# EAGLE board PCB-E21-CMB6_v11-16 (EAGLE 7.7.0), part 1 of 2
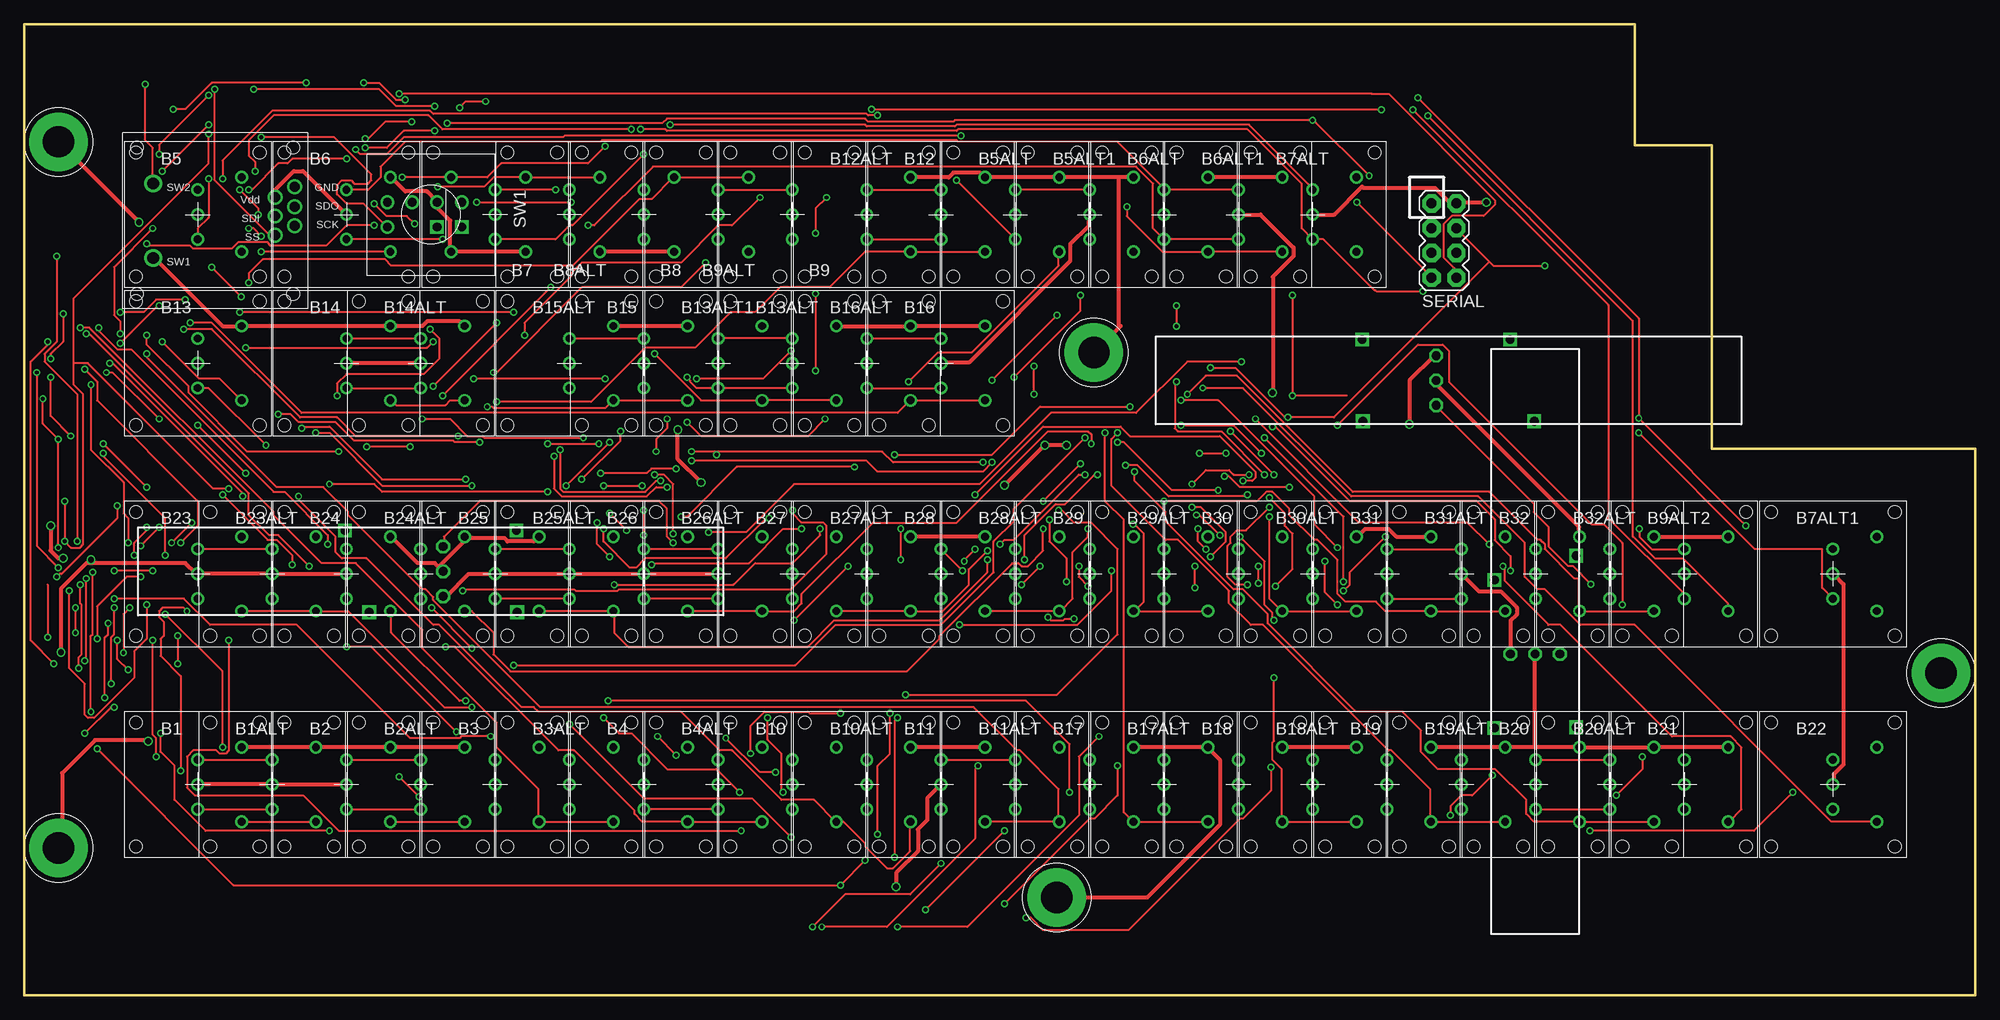
[diagram p6: board, top side]
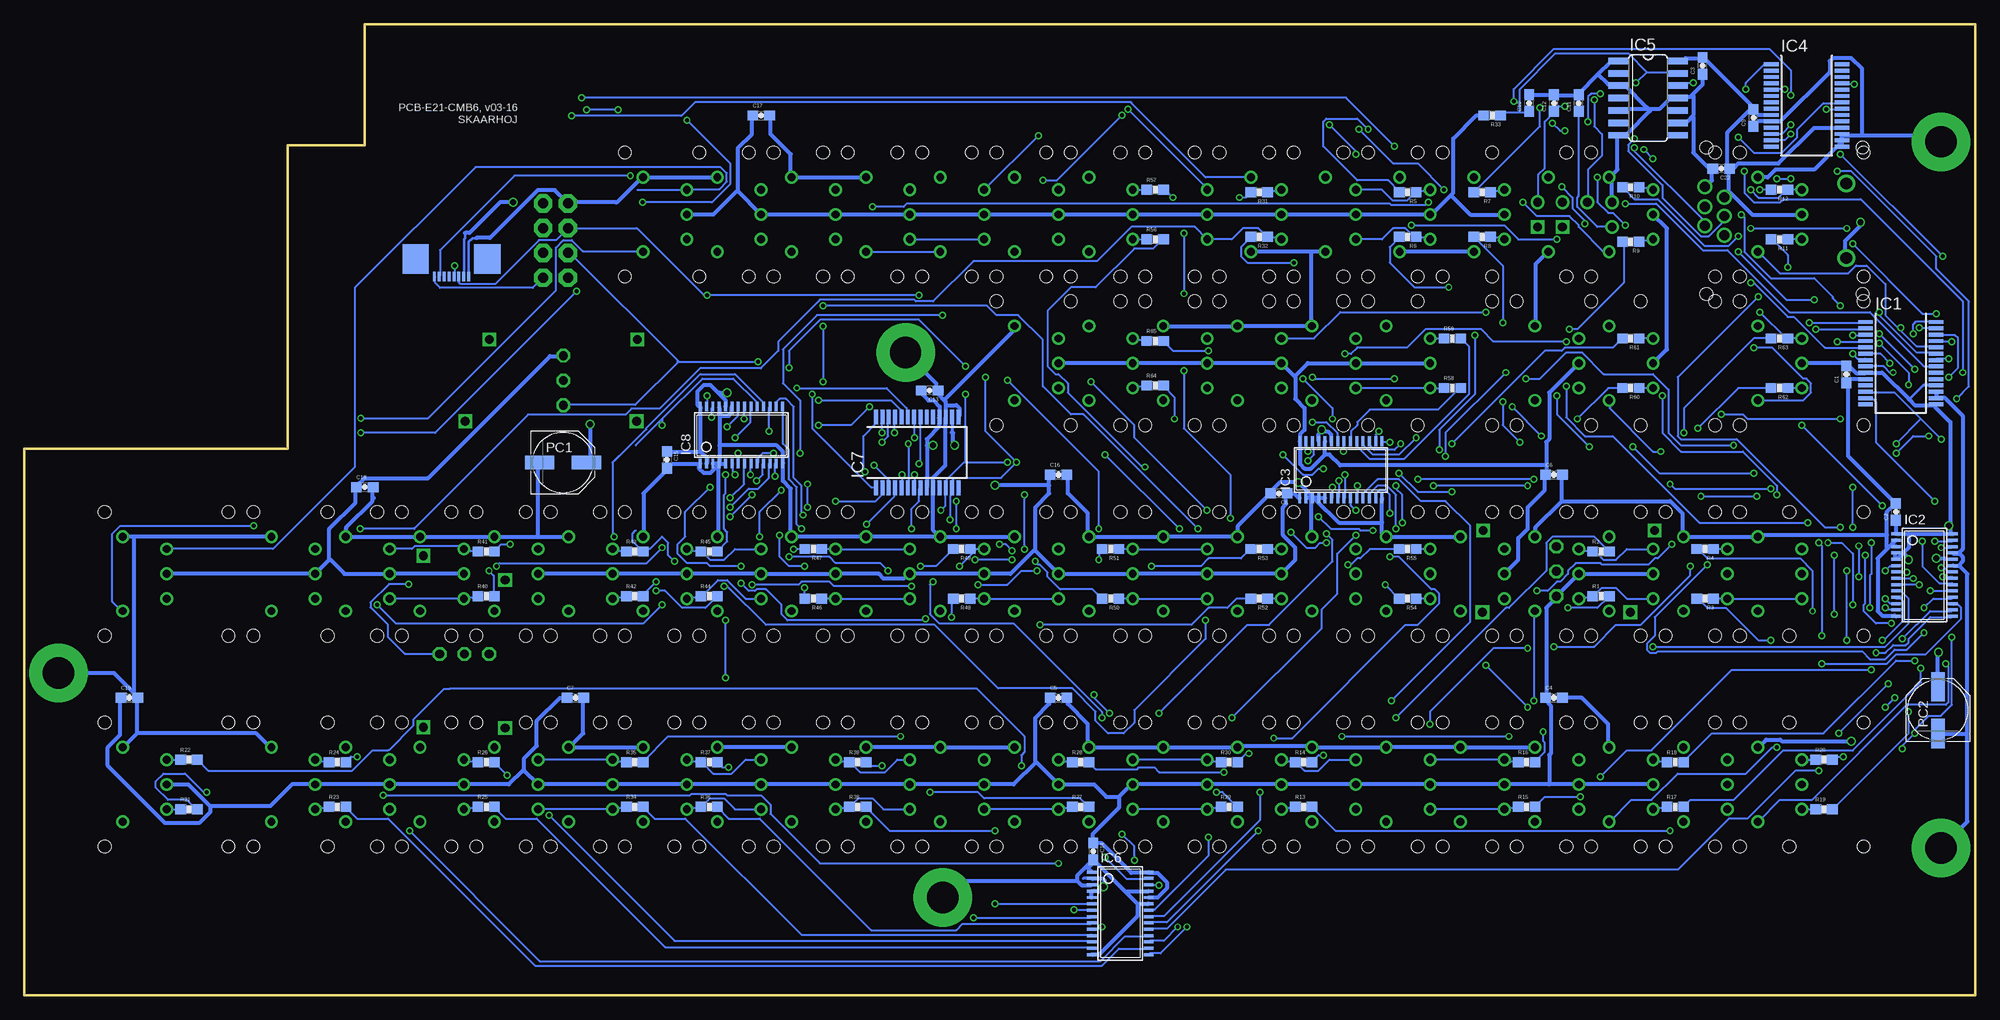
[diagram p7: board, bottom side, seen from below]

Size 200 x 99.5 mm. Coordinates in mm from the lower left corner, seen from the top.
Outline: 0,99.5 0,0 200,0 200,56 173.03,56 173.03,87.12 165.1,87.12 165.1,99.5 0,99.5
Copper layers (1*16): Top 0.035mm / dielectric 1.5mm / Bottom 0.035mm
Design rules "Fusion_eagle_rule_v1.1": minimum track width 6mil, minimum drill 12mil, track to track 6mil, track to pad 6mil, pad to pad 6mil, via to via 6mil, smd to smd 0mil, copper to edge 10mil, drill to drill 10mil, minimum pad ring 10mil, minimum via ring 6mil, stop-mask expansion 2mil, vias tented up to drill 100mil, thermal gap 10mil
Net classes: 0 default: width 0.203 mm, drill 0.406 mm, clearance 0.152 mm; 1 Power: width 0.406 mm, drill 0.61 mm, clearance 0.203 mm
tRestrict: area 0,0 to 223,6.5; area 0,94 to 223,100
bRestrict: area 0,97.5 to 223,100; area 0,0 to 223,2.5

## Footprints (pad centres in the part's own frame; a part is rotated, then mirrored left to right if it is on the bottom)
LP11 = drill 0.8: COM 0,0; P$2 0,2.54; P$3 0,-2.54; P$4 4.5,3.81; P$5 4.5,-3.81 | hole 1.3: -6.35,6.35; 6.35,6.35; 6.35,-6.35; -6.35,-6.35
0603-CAP = smd 1.1 x 1: 1 -0.85,0; 2 0.85,0
SSOP28 = smd 0.4 x 1.5: 1 -4.225,-3.625; 2 -3.575,-3.625; 3 -2.925,-3.625; 4 -2.275,-3.625; 5 -1.625,-3.625; 6 -0.975,-3.625; 7 -0.325,-3.625; 8 0.325,-3.625; 9 0.975,-3.625; 10 1.625,-3.625; 11 2.275,-3.625; 12 2.925,-3.625; 13 3.575,-3.625; 14 4.225,-3.625; 15 4.225,3.625; 16 3.575,3.625; 17 2.925,3.625; 18 2.275,3.625; 19 1.625,3.625; 20 0.975,3.625; 21 0.325,3.625; 22 -0.325,3.625; 23 -0.975,3.625; 24 -1.625,3.625; 25 -2.275,3.625; 26 -2.925,3.625; 27 -3.575,3.625; 28 -4.225,3.625
TSSOP28 = smd 0.305 x 0.991: 1 -4.225,-2.918; 2 -3.575,-2.918; 3 -2.925,-2.918; 4 -2.275,-2.918; 5 -1.625,-2.918; 6 -0.975,-2.918; 7 -0.325,-2.918; 8 0.325,-2.918; 9 0.975,-2.918; 10 1.625,-2.918; 11 2.275,-2.918; 12 2.925,-2.918; 13 3.575,-2.918; 14 4.225,-2.918; 15 4.225,2.918; 16 3.575,2.918; 17 2.925,2.918; 18 2.275,2.918; 19 1.625,2.918; 20 0.975,2.918; 21 0.325,2.918; 22 -0.325,2.918; 23 -0.975,2.918; 24 -1.625,2.918; 25 -2.275,2.918; 26 -2.925,2.918; 27 -3.575,2.918; 28 -4.225,2.918
SO14 = smd 0.66 x 2.032: 1 -3.81,-3.073; 2 -2.54,-3.073; 3 -1.27,-3.073; 4 0,-3.073; 5 1.27,-3.073; 6 2.54,-3.073; 7 3.81,-3.073; 8 3.81,3.073; 9 2.54,3.073; 10 1.27,3.073; 11 0,3.073; 12 -1.27,3.073; 13 -2.54,3.073; 14 -3.81,3.073
PANASONIC_D = smd 3 x 1.4: + 2.4,0; - -2.4,0
SLIDER45-CAR1 = drill 0.9 octagon: 1 -1.27,2.54; 2A -1.27,-2.54; 3 -1.27,0 | drill 0.9 square: P$1 -8.852,4.191; P$2 6.312,4.191; P$3 8.788,-4.191; P$4 -8.788,-4.191
0603-RES = smd 1.1 x 1: 1 -0.85,0; 2 0.85,0
2X4 = drill 1.016 pad 1.88 octagon: 1 -3.81,-1.27; 2 -3.81,1.27; 3 -1.27,-1.27; 4 -1.27,1.27; 5 1.27,-1.27; 6 1.27,1.27; 7 3.81,-1.27; 8 3.81,1.27
SMART_SWITCH = drill 1.2: 1 6.35,3.81; 2 6.35,-3.81 | drill 1: 3 -8.153,-3.48; 4 -6.147,-2.413; 5 -8.153,-1.422; 6 -6.147,-0.483; 7 -8.153,0.508; 8 -6.147,1.499 | hole 1.3: -8.001,7.506; 8.001,7.506; 8.001,-7.506; -8.001,-7.506
ALPS_EC12E_SW-CAR1 = drill 0.9: A 1.27,-4.445; B -1.27,-1.905; C -1.27,-4.445; D -1.27,0.635; E -1.27,3.175 | drill 0.9 square: GND1 1.27,3.175; GND2 1.27,0.635
3.2MMPAD6MM = drill 3.2 pad 6: P$1 0,0
ZIP-8-0.5 = smd 2.7 x 3: GND$1 3.68,-1.8; GND$9 -3.68,-1.8 | smd 0.3 x 0.96: P$1 -1.75,0; P$2 -1.25,0; P$3 -0.75,0; P$4 -0.25,0; P$5 0.25,0; P$6 0.75,0; P$7 1.25,0; P$8 1.75,0

## Placement (x,y rotation side)
B1  LP11-B"  [LP11]  17.78,21.59 0 top
B1ALT  LP11-B"  [LP11]  25.4,21.59 0 top
B2  LP11-B"  [LP11]  33.02,21.59 0 top
B2ALT  LP11-B"  [LP11]  40.64,21.59 0 top
B3  LP11-B"  [LP11]  48.26,21.59 0 top
B3ALT  LP11-B"  [LP11]  55.88,21.59 0 top
B4  LP11-B"  [LP11]  63.5,21.59 0 top
B4ALT  LP11-B"  [LP11]  71.12,21.59 0 top
B5  LP11-B"  [LP11]  17.78,80.01 0 top
B5ALT  LP11-B"  [LP11]  101.6,80.01 0 top
B5ALT1  LP11-B"  [LP11]  109.22,80.01 0 top
B6  LP11-B"  [LP11]  33.02,80.01 0 top
B6ALT  LP11-B"  [LP11]  116.84,80.01 0 top
B6ALT1  LP11-B"  [LP11]  124.46,80.01 0 top
B7  LP11-B"  [LP11]  48.26,80.01 180 top
B7ALT  LP11-B"  [LP11]  132.08,80.01 0 top
B7ALT1  LP11-B"  [LP11]  185.42,43.18 0 top
B8  LP11-B"  [LP11]  63.5,80.01 180 top
B8ALT  LP11-B"  [LP11]  55.88,80.01 180 top
B9  LP11-B"  [LP11]  78.74,80.01 180 top
B9ALT  LP11-B"  [LP11]  71.12,80.01 180 top
B9ALT2  LP11-B"  [LP11]  170.18,43.18 0 top
B10  LP11-B"  [LP11]  78.74,21.59 0 top
B10ALT  LP11-B"  [LP11]  86.36,21.59 0 top
B11  LP11-B"  [LP11]  93.98,21.59 0 top
B11ALT  LP11-B"  [LP11]  101.6,21.59 0 top
B12  LP11-B"  [LP11]  93.98,80.01 0 top
B12ALT  LP11-B"  [LP11]  86.36,80.01 0 top
B13  LP11-B"  [LP11]  17.78,64.77 0 top
B13ALT  LP11-B"  [LP11]  78.74,64.77 0 top
B13ALT1  LP11-B"  [LP11]  71.12,64.77 0 top
B14  LP11-B"  [LP11]  33.02,64.77 0 top
B14ALT  LP11-B"  [LP11]  40.64,64.77 0 top
B15  LP11-B"  [LP11]  63.5,64.77 0 top
B15ALT  LP11-B"  [LP11]  55.88,64.77 0 top
B16  LP11-B"  [LP11]  93.98,64.77 0 top
B16ALT  LP11-B"  [LP11]  86.36,64.77 0 top
B17  LP11-B"  [LP11]  109.22,21.59 0 top
B17ALT  LP11-B"  [LP11]  116.84,21.59 0 top
B18  LP11-B"  [LP11]  124.46,21.59 0 top
B18ALT  LP11-B"  [LP11]  132.08,21.59 0 top
B19  LP11-B"  [LP11]  139.7,21.59 0 top
B19ALT  LP11-B"  [LP11]  147.32,21.59 0 top
B20  LP11-B"  [LP11]  154.94,21.59 0 top
B20ALT  LP11-B"  [LP11]  162.56,21.59 0 top
B21  LP11-B"  [LP11]  170.18,21.59 0 top
B22  LP11-B"  [LP11]  185.42,21.59 0 top
B23  LP11-B"  [LP11]  17.78,43.18 0 top
B23ALT  LP11-B"  [LP11]  25.4,43.18 0 top
B24  LP11-B"  [LP11]  33.02,43.18 0 top
B24ALT  LP11-B"  [LP11]  40.64,43.18 0 top
B25  LP11-B"  [LP11]  48.26,43.18 0 top
B25ALT  LP11-B"  [LP11]  55.88,43.18 0 top
B26  LP11-B"  [LP11]  63.5,43.18 0 top
B26ALT  LP11-B"  [LP11]  71.12,43.18 0 top
B27  LP11-B"  [LP11]  78.74,43.18 0 top
B27ALT  LP11-B"  [LP11]  86.36,43.18 0 top
B28  LP11-B"  [LP11]  93.98,43.18 0 top
B28ALT  LP11-B"  [LP11]  101.6,43.18 0 top
B29  LP11-B"  [LP11]  109.22,43.18 0 top
B29ALT  LP11-B"  [LP11]  116.84,43.18 0 top
B30  LP11-B"  [LP11]  124.46,43.18 0 top
B30ALT  LP11-B"  [LP11]  132.08,43.18 0 top
B31  LP11-B"  [LP11]  139.7,43.18 0 top
B31ALT  LP11-B"  [LP11]  147.32,43.18 0 top
B32  LP11-B"  [LP11]  154.94,43.18 0 top
B32ALT  LP11-B"  [LP11]  162.56,43.18 0 top
C1  100nF  [0603-CAP]  13.21,63.63 90 bottom
C2  100nF  [0603-CAP]  8.13,49.53 90 bottom
C3  100nF  [0603-CAP]  27.94,95.25 90 bottom
C4  100nF  [0603-CAP]  43.18,30.48 0 bottom
C5  100nF  [0603-CAP]  93.98,30.48 0 bottom
C6  100nF  [0603-CAP]  43.18,53.34 0 bottom
C7  100nF  [0603-CAP]  143.51,30.48 0 bottom
C8  100nF  [0603-CAP]  71.37,51.44 180 bottom
C9  100nF  [0603-CAP]  22.73,89.92 90 bottom
C10  10nF  [0603-CAP]  45.72,91.44 90 bottom
C11  10nF  [0603-CAP]  40.64,91.44 90 bottom
C12  10nF  [0603-CAP]  43.18,91.44 90 bottom
C13  100nF  [0603-CAP]  107.19,61.98 180 bottom
C14  100nF  [0603-CAP]  90.42,14.73 270 bottom
C15  100nF  [0603-CAP]  134.11,54.86 270 bottom
C16  100nF  [0603-CAP]  93.98,53.34 0 bottom
C17  100nF  [0603-CAP]  124.46,90.17 0 bottom
C18  100nF  [0603-CAP]  165.1,52.07 0 bottom
C19  100nF  [0603-CAP]  189.23,30.48 0 bottom
C22  100nF  [0603-CAP]  26.04,84.71 180 bottom
IC1  MCP23017SS  [SSOP28]  7.62,64.77 270 bottom
IC2  PCA9685  [TSSOP28]  5.21,43.05 270 bottom
IC3  PCA9685  [TSSOP28]  65.02,53.85 0 bottom
IC4  MCP23017SS  [SSOP28]  17.27,91.19 270 bottom
IC5  74HCT14D  [SO14]  33.53,91.95 270 bottom
IC6  PCA9685  [TSSOP28]  87.63,8.38 270 bottom
IC7  MCP23017SS  [SSOP28]  108.46,55.63 0 bottom
IC8  PCA9685  [TSSOP28]  126.49,57.4 0 bottom
PC1  47u  [PANASONIC_D]  144.78,54.61 0 bottom
PC2  47u  [PANASONIC_D]  3.81,29.21 90 bottom
POT1  SLIDERC45  [SLIDER45-CAR1]  41.66,43.43 180 top
POT1ALT  SLIDERC45  [SLIDER45-CAR1]  146.01,63.01 0 top
POT2  SLIDERC45  [SLIDER45-CAR1]  154.89,36.24 90 top
R1  270  [0603-RES]  38.35,40.89 0 bottom
R2  270  [0603-RES]  38.35,45.47 0 bottom
R3  270  [0603-RES]  27.69,40.64 180 bottom
R4  270  [0603-RES]  27.69,45.72 180 bottom
R5  270  [0603-RES]  58.17,82.3 180 bottom
R6  270  [0603-RES]  58.17,77.72 180 bottom
R7  270  [0603-RES]  50.55,82.3 180 bottom
R8  270  [0603-RES]  50.55,77.72 180 bottom
R9  270  [0603-RES]  35.31,77.22 180 bottom
R10  270  [0603-RES]  35.31,82.8 180 bottom
R11  270  [0603-RES]  20.07,77.47 180 bottom
R12  270  [0603-RES]  20.07,82.55 180 bottom
R13  270  [0603-RES]  68.83,19.3 0 bottom
R14  270  [0603-RES]  68.83,23.88 0 bottom
R15  270  [0603-RES]  45.97,19.3 0 bottom
R16  270  [0603-RES]  45.97,23.88 0 bottom
R17  270  [0603-RES]  30.73,19.3 0 bottom
R18  270  [0603-RES]  30.73,23.88 0 bottom
R19  270  [0603-RES]  15.49,19.05 0 bottom
R20  270  [0603-RES]  15.49,24.13 0 bottom
R21  270  [0603-RES]  183.13,19.05 0 bottom
R22  270  [0603-RES]  183.13,24.13 0 bottom
R23  270  [0603-RES]  167.89,19.3 0 bottom
R24  270  [0603-RES]  167.89,23.88 0 bottom
R25  270  [0603-RES]  152.65,19.3 0 bottom
R26  270  [0603-RES]  152.65,23.88 0 bottom
R27  270  [0603-RES]  91.69,19.3 0 bottom
R28  270  [0603-RES]  91.69,23.88 0 bottom
R29  270  [0603-RES]  76.45,19.3 0 bottom
R30  270  [0603-RES]  76.45,23.88 0 bottom
R31  270  [0603-RES]  73.41,82.3 180 bottom
R32  270  [0603-RES]  73.41,77.72 180 bottom
R33  100K  [0603-RES]  49.53,90.17 180 bottom
R34  270  [0603-RES]  137.41,19.3 0 bottom
R35  270  [0603-RES]  137.41,23.88 0 bottom
R36  270  [0603-RES]  129.79,19.3 0 bottom
R37  270  [0603-RES]  129.79,23.88 0 bottom
R38  270  [0603-RES]  114.55,19.3 0 bottom
R39  270  [0603-RES]  114.55,23.88 0 bottom
R40  270  [0603-RES]  152.65,40.89 0 bottom
R41  270  [0603-RES]  152.65,45.47 0 bottom
R42  270  [0603-RES]  137.41,40.89 0 bottom
R43  270  [0603-RES]  137.41,45.47 0 bottom
R44  270  [0603-RES]  129.79,40.89 0 bottom
R45  270  [0603-RES]  129.79,45.47 0 bottom
R46  270  [0603-RES]  119.13,40.64 180 bottom
R47  270  [0603-RES]  119.13,45.72 180 bottom
R48  270  [0603-RES]  103.89,40.64 180 bottom
R49  270  [0603-RES]  103.89,45.72 180 bottom
R50  270  [0603-RES]  88.65,40.64 180 bottom
R51  270  [0603-RES]  88.65,45.72 180 bottom
R52  270  [0603-RES]  73.41,40.64 180 bottom
R53  270  [0603-RES]  73.41,45.72 180 bottom
R54  270  [0603-RES]  58.17,40.64 180 bottom
R55  270  [0603-RES]  58.17,45.72 180 bottom
R56  270  [0603-RES]  84.07,77.47 0 bottom
R57  270  [0603-RES]  84.07,82.55 0 bottom
R58  270  [0603-RES]  53.59,62.23 0 bottom
R59  270  [0603-RES]  53.59,67.31 0 bottom
R60  270  [0603-RES]  35.31,62.23 180 bottom
R61  270  [0603-RES]  35.31,67.31 180 bottom
R62  270  [0603-RES]  20.07,62.23 180 bottom
R63  270  [0603-RES]  20.07,67.31 180 bottom
R64  270  [0603-RES]  84.07,62.48 0 bottom
R65  270  [0603-RES]  84.07,67.06 0 bottom
SERIAL  M04X2  [2X4]  145.54,77.34 270 top
SSW1  SMART_SWITCHSMART_SWITCH_8PIN  [SMART_SWITCH]  19.56,79.38 180 top
SW1  EC12E_SWCAR1  [ALPS_EC12E_SW-CAR1]  41.67,80.01 270 top
U$25  GNDPAD6MM  [3.2MMPAD6MM]  3.5,87.46 0 top
U$26  GNDPAD6MM  [3.2MMPAD6MM]  105.84,10 0 top
U$27  GNDPAD6MM  [3.2MMPAD6MM]  109.65,65.87 0 top
U$28  GNDPAD6MM  [3.2MMPAD6MM]  3.5,15.08 0 top
U$51  GNDPAD6MM  [3.2MMPAD6MM]  196.5,33.02 0 top
U$94  M04X2ZIF-0.5  [ZIP-8-0.5]  156.21,73.66 180 bottom

## Tracks (layer width: path | path; a pad name or v marks a point on that pad's centre or on a via)
5V  (via drill 0.61)
  Top 0.406: B1.COM B1ALT.COM B2.COM | v89.38,11.11 89.38,12.54 91.6,14.76 91.6,16.99 92.55,17.94 92.55,20.16 B11.COM | 137.15,82.85 134.3,80.01 B7ALT.COM | 137.15,82.85 137.16,82.87 | B24.COM B23ALT.COM B23.COM 17.62,43.18 16.51,44.29 6.83,44.29 | 6.83,44.29 6.35,44.29 3.81,41.75 3.75,41.62 v3.75,35.12 | v6.83,44.61 6.83,44.29 | B6.COM 28.57,84.45 27.62,84.45 25.72,82.55 25.72,81.92 SSW1.4 | B14ALT.COM B14.COM | POT1.1 43.02,40.96 43.34,40.96 45.56,43.18 B25.COM B25ALT.COM B26.COM B26ALT.COM | v106.84,56.36 v104.62,56.36 104.5,56.25 v100.5,52.25 | v3.97,44.77 3.49,44.77 2.7,45.56 v2.7,48.1 | v149.88,81.25 146.88,81.25 SERIAL.2 146.62,81.12 146.25,81.12 144.62,82.75 137.25,82.75 137.15,82.85 | v127.95,61.75 128,61.88 128,73.62 130.12,75.75 130.12,76.62 126.75,80 124.5,80 B6ALT1.COM | 162.5,43.25 B32ALT.COM | B5ALT1.COM 109.12,80 109.12,78.88 107.25,77 107.25,75.25 96.88,64.88 94,64.88 B16.COM | v142,58.5 142,63 144.5,65.5 POT1ALT.1 | B31ALT.COM 149.12,41.38 151.38,41.38 153,39.75 153,39 152.38,38.38 152.38,35 POT2.1 | B22.COM 185.5,21.62 185.5,22.62 186.5,23.62 186.5,42.12 185.5,43.12 B7ALT1.COM
  Bottom 0.254: U$94.P$2 154.94,73.68 154.94,77.47 154.81,77.6 154.81,78.11
  Bottom 0.305: IC7.16 104.9,59.25 104.9,57.66 | IC6.2 91.44,11.96 91.44,11.94 | IC1.18 5.32,62.49 6.76,61.05 | IC2.24 3.02,44.68 3.05,44.7
  Bottom 0.406: IC4.9 22.18,90.21 C9.2 | C13.2 108.04,61.68 107.31,60.96 106.81,60.96 106.17,60.33 106.17,59.26 IC7.18 106.2,59.05 106.2,58.26 107.47,56.99 107.47,56.36 | IC6.24 84.61,10 83.82,10 82.87,10.95 82.87,11.59 83.82,12.54 84.61,12.54 IC6.28 84.77,12.54 86.52,12.54 89.53,15.56 90.33,15.56 C14.1 90.49,15.72 90.49,16.51 87.79,19.21 87.79,20.32 | B2.COM B2ALT.COM 43.66,21.59 | 43.66,21.59 B3.COM B3ALT.COM B4.COM B4ALT.COM B10.COM B10ALT.COM 86.52,21.59 87.79,20.32 | 180.97,19.37 180.97,18.73 182.09,17.62 185.58,17.62 191.45,23.5 191.45,25.4 190.18,26.67 190.18,30.48 C19.1 | 180.97,19.37 183.2,21.59 B22.COM | C7.1 145.1,30.48 147.48,28.1 147.48,25.56 148.75,24.29 148.75,23.02 | 148.75,23.02 B19ALT.COM B19.COM B18ALT.COM B18.COM B17ALT.COM B17.COM B11ALT.COM 98.58,21.59 96.36,23.81 96.36,23.97 | 148.75,23.02 148.91,23.02 150.34,21.59 B20.COM B20ALT.COM B21.COM 172.56,21.59 174.78,19.37 180.97,19.37 | IC6.5 90.65,10 90.65,10.64 IC6.4 90.49,10.64 89.85,10.64 v89.38,11.11 89.38,11.27 89.22,11.43 89.22,11.75 89.38,11.91 90.49,11.91 IC6.2 | 96.36,23.97 96.36,28.42 94.93,29.84 94.93,30.48 C5.1 | 96.36,23.97 B11.COM 90.33,21.59 89.06,20.32 87.79,20.32 | 126.84,82.39 126.84,86.84 125.41,88.27 125.41,90.17 C17.1 | 126.84,82.39 B6ALT1.COM B6ALT.COM B5ALT1.COM B5ALT.COM B12.COM B12ALT.COM B9.COM B9ALT.COM B8.COM B8ALT.COM 55.72,80.01 53.74,81.99 | B7ALT.COM 129.38,80.01 127,82.39 126.84,82.39 | R33.2 51.12,90.17 53.5,87.79 53.5,82.23 53.74,81.99 | B7.COM 51.75,80.01 53.74,81.99 | 107.47,56.36 107.47,52.07 IC7.9 | 128.83,61.67 129.7,62.55 130.33,62.55 130.97,61.91 130.97,60.48 130.81,60.33 IC8.28 130.65,60.17 130.65,55.72
  Bottom 0.406: 128.83,61.67 128.11,60.96 IC8.24 | 130.65,55.72 130.02,55.09 130.02,54.61 IC8.2 | 130.65,55.72 133.99,55.72 C15.1 | v127.95,61.75 128.75,61.75 128.83,61.67 | B15ALT.COM B15.COM 68.42,64.77 69.69,63.5 69.69,63.34 | 66.67,55.4 66.67,56.67 IC3.24 | 66.67,55.4 68.1,53.98 68.74,53.98 69.22,54.45 69.22,56.67 IC3.28 69.22,56.83 69.22,57.47 68.74,57.94 68.74,60.17 69.69,61.12 69.69,63.34 | 69.69,63.34 B13ALT1.COM B13ALT.COM B16ALT.COM B16.COM | 168.75,44.61 168.75,47.78 166.05,50.48 166.05,52.07 C18.1 165.88,52.25 165.12,53 158.62,53 146.12,65.5 144.75,65.5 POT1ALT.1 | 168.75,44.61 B9ALT2.COM B7ALT1.COM | 168.75,44.61 168.59,44.61 167.16,43.18 B32ALT.COM B32.COM | B31ALT.COM B31.COM B30ALT.COM B30.COM B29ALT.COM 112.39,43.18 111.92,42.7 109.86,42.7 109.38,43.18 B29.COM B28ALT.COM 98.9,43.18 96.52,45.56 96.36,45.56 | IC2.4 8.26,45.24 8.26,44.77 IC2.5 7.94,44.77 7.38,45.32 | 8.1,47.31 6.83,47.31 | 6.83,47.31 2.54,47.31 | 2.54,47.31 2.38,47.31 IC2.28 | 8.1,47.31 IC2.1 | 8.1,47.31 8.1,48.58 C2.1 | 7.38,45.32 6.83,45.88 6.83,47.31 | 4.13,60.48 6.19,60.48 6.76,61.05 9.53,63.82 11.11,63.82 IC1.9 11.29,63.75 12.19,63.75 12.91,64.48 C1.2 13.02,64.61 13.18,64.77 B13.COM | 4.13,60.48 IC1.15 | 2.54,48.1 2.54,58.74 4.13,60.33 4.13,60.48 | 2.54,48.1 2.54,47.31 | 7.38,45.32 6.83,44.77 v6.83,44.61 | IC3.1 69.37,50.96 69.85,51.44 C8.1 70.64,51.28 70.64,50.32 70.96,50.01 70.96,47.15 69.69,45.88 69.69,44.61 B26ALT.COM B27.COM B27ALT.COM B28.COM 96.36,45.56 | 94.93,52.25 94.93,51.44 96.36,50.01 96.36,45.56 | 94.93,52.25 94.93,53.34 C16.1 | IC5.14 30.32,95.73 30,95.73 29.69,96.04 27.94,96.04 C3.2 27.78,96.04 22.7,90.96 C9.2
  Bottom 0.406: 25.24,82.23 25.24,84.61 C22.1 | 25.24,82.23 25.56,81.92 SSW1.4 | IC4.18 16.51,88.9 20.16,85.25 24.29,85.25 24.77,84.77 25.08,84.77 C22.1 | B5.COM 22.86,80.01 25.08,82.23 25.24,82.23 | C9.2 22.86,90.65 23.18,90.65 25.4,88.42 25.4,84.61 C22.1 | 43.97,54.29 43.97,56.67 43.66,56.99 43.66,61.75 B14ALT.COM | 43.97,54.29 43.97,53.34 C6.1 44.13,53.18 44.13,51.75 45.88,50.01 45.88,47.78 46.83,46.83 46.83,44.61 B25.COM | B6.COM 31.59,78.58 31.59,66.2 B14.COM | B24.COM B24ALT.COM POT1.1 42.86,40.8 43.97,39.69 43.97,30.48 C4.1 44.13,30.32 43.5,29.69 43.5,24.77 43.66,24.61 43.66,21.59 | 66.67,55.4 66.2,55.4 65.09,54.29 43.97,54.29 | v104.62,56.36 104.78,56.52 104.78,57.63 104.9,57.66 | 107.47,56.36 v106.84,56.36 | v3.97,44.77 3.17,44.77 3.05,44.7 | v2.7,48.1 2.54,48.1 | v149.88,81.25 151.25,81.25 154.38,78.12 154.75,78.12 154.81,78.11 | 94.93,52.25 v100.5,52.25 | v3.75,35.12 3.88,35 3.88,31.62 PC2.+ | v142,58.5 142,55 PC1.+
A0  (via drill 0.41)
  Top 0.203: v66.52,46.35 65.88,46.99 65.88,49.85 65.09,50.64 46.67,50.64 43.02,46.99 43.02,46.04 POT1.2A | v70.17,47.47 73.98,47.47 78.9,52.39 97.95,52.39 105.25,59.69 113.98,59.69 119.22,64.93 v124.78,64.93 | v160.62,42.12 158.75,44 158.25,44 156.25,46 156.25,48 154.75,49.5 154.75,50.38 144.75,60.38 POT1ALT.2A
  Bottom 0.203: v66.52,46.35 67.15,46.35 67.63,45.88 68.58,45.88 v70.17,47.47 | 133.03,64.93 133,64.93 | 133,64.93 v124.78,64.93 | POT1ALT.2A 144.62,60.5 137.38,60.5 133,64.88 133,64.93 | SERIAL.5 144.25,76 144,76 133,65 133,64.93 | v160.62,42.12 162.62,42.12 164.5,40.25 164.5,39.75 162.75,38 162.75,36.75 161,35 157.5,35 POT2.2A
AD0  (via drill 0.41)
  Top 0.203: v23.5,92.87 36.35,92.87 38.1,91.12 v42.07,91.12
  Bottom 0.203: SW1.E 44.77,81.28 44.77,84.14 44.13,84.77 44.13,89.53 43.18,90.49 C12.1 43.18,90.65 42.7,91.12 v42.07,91.12 | v23.5,92.87 23.5,93.5 21.59,95.41 20.95,95.41 IC4.1
D2  (via drill 0.41)
  Top 0.203: v15.24,90.81 16.51,90.81 19.21,93.5 v28.89,93.5
  Bottom 0.203: v15.24,90.81 13.65,90.81 IC4.21 | v28.89,93.5 30.16,93.5 30.32,93.34 IC5.12
D3  (via drill 0.41)
  Top 0.203: v24.29,87.95 31.75,87.95 35.56,84.14 35.56,83.5 35.24,83.19 33.81,83.19 33.5,83.5 32.54,83.5 32.07,83.03 32.07,82.07 33.02,81.12 34.77,81.12 37.15,78.74 SW1.A
  Bottom 0.203: C11.1 40.64,81.92 40.8,81.76 40.8,80.8 38.73,78.74 SW1.A | v24.29,87.95 22.7,86.36 19.84,86.36 18.26,87.95 18.26,88.74 15.56,91.44 13.65,91.44 IC4.22
GND  (via drill 0.61)
  Top 0.406: B16.P$4 B16ALT.P$4 B13ALT.P$4 | B15.P$4 B15ALT.P$4 | B9ALT.P$4 B8.P$4 | SSW1.1 13.34,75.56 20.32,68.58 B13.P$4 B14.P$4 40.8,68.58 41.27,69.06 44.61,69.06 45.09,68.58 B14ALT.P$4 | B8ALT.P$4 B7.P$4 43.66,76.36 43.66,79.38 42.39,80.64 42.39,81.28 SW1.D 42.23,81.44 41.27,82.39 39.05,82.39 37.62,83.82 B6.P$4 | v11.75,79.22 3.65,87.31 U$25.P$1 | B24.P$4 37.62,46.99 40.32,44.29 42.07,44.29 POT1.3 42.55,43.97 45.09,46.51 45.09,46.99 B24ALT.P$4 45.24,46.83 49.21,46.83 49.53,46.51 52.23,46.51 52.7,46.99 B25.P$4 | v66.99,57.94 66.99,54.93 v69.37,52.55 | B12ALT.P$4 94.77,83.82 95.25,84.3 97.95,84.3 98.42,83.82 B12.P$4 B5ALT.P$4 112.24,83.82 | B5ALT1.P$4 112.24,83.82 | B6ALT1.P$4 B6ALT.P$4 | B32ALT.P$4 B9ALT2.P$4 | U$27.P$1 109.7,65.88 112.39,68.58 112.24,68.58 112.24,83.82 | B31.P$4 140.65,46.99 139.86,47.78 137.48,47.78 136.68,46.99 B30ALT.P$4 | B28.P$4 B27ALT.P$4 | B21.P$4 B20ALT.P$4 B20.P$4 154.88,25.4 | B18ALT.P$4 B18.P$4 | 154.88,25.4 B19ALT.P$4 B19.P$4 | 3.81,15.24 3.65,15.08 U$28.P$1 3.88,15.38 3.88,22.75 7.25,26.12 12.62,26.12 v12.7,26.04 | B1.P$4 B1ALT.P$4 B2.P$4 B2ALT.P$4 | B17.P$4 B17ALT.P$4 121.44,25.24 122.56,24.13 122.56,17.46 115.09,10 105.89,10 U$26.P$1 | B11.P$4 B10ALT.P$4 | POT1ALT.3 144.75,62.62 159.38,48 159.38,47 B32.P$4 | 154.88,25.4 154.88,34.88 POT2.3
  Bottom 0.254: U$94.P$1 154.43,73.69 154.43,77.22 154.05,77.6 153.67,77.6
  Bottom 0.406: IC1.10 12.84,63.15 C1.1 13.02,62.71 13.02,55.24 8.26,50.48 C2.2 8.26,50.32 9.05,49.53 9.05,47.15 | C9.1 22.24,89.56 IC4.10 20.8,89.53 20,89.53 14.92,94.61 14.92,95.73 14.61,96.04 12.7,96.04 11.59,94.93 11.59,88.11 | 105.7,60.99 106.34,61.63 C13.1 106.52,62.07 106.52,62.71 109.54,65.72 U$27.P$1 | 105.7,60.99 105.54,60.83 105.54,60.48 | 105.54,60.48 IC7.17 105.57,59.05 105.57,54.29 106.84,53.02 106.84,52.07 IC7.10 106.84,51.91 106.84,47.62 106.2,46.99 B28ALT.P$4 | B13ALT.P$4 B13ALT1.P$4 B15.P$4 68.1,68.58 68.1,76.2 | B9ALT.P$4 68.1,76.2 | 68.1,76.2 B9.P$4 | 13.65,87.31 13.65,87.47 IC4.16 13.65,87.79 13.65,88.11 IC4.17 13.49,88.11 11.59,88.11 | 13.65,87.31 13.65,87 IC4.15 | 11.59,88.11 4.29,88.11 3.65,87.47 U$25.P$1 | B5.P$4 21.27,83.82 20.48,84.61 16.51,84.61 13.81,87.31 13.65,87.31 | C10.2 45.72,92.23 43.34,92.23 C12.2 43.18,92.23 40.64,92.23 C11.2 40.64,92.39 38.66,94.38 | 38.66,94.38 37.31,95.73 36.67,95.73 IC5.1 | SW1.C 37.31,81.28 37.31,83.82 B6.P$4 37.47,83.82 36.67,84.61 36.67,88.11 IC5.7 36.51,88.27 35.72,88.27 33.34,90.65 33.34,90.81 | SSW1.3 27.62,82.87 26.99,83.5 26.99,84.61 C22.2 27.15,84.61 28.89,86.36 28.89,90.01 28.97,90.09 | C3.1 27.94,93.34 28.97,92.31 | 28.97,92.31 29.21,92.08 30.32,92.08 IC5.11 30.64,91.92 31.27,91.92 32.38,90.81 33.34,90.81 | 28.97,90.09 28.89,90.17 28.89,92.23 28.97,92.31 | 28.97,90.09 29.53,89.53 30.32,89.53 IC5.9 | 33.34,90.81 33.66,90.81 | 33.66,90.81 36.51,90.81 IC5.5 | 33.66,90.81 33.66,90.96 35.88,93.19 36.51,93.19 IC5.3 36.67,93.34 37.62,93.34 38.66,94.38 | B14ALT.P$4 45.09,68.58 45.09,74.93 43.81,76.2 B7.P$4
  Bottom 0.406: v11.75,79.22 11.75,78.9 13.34,77.31 13.34,75.56 SSW1.1 | B8ALT.P$4 B8.P$4 | 8.49,46.28 8.26,46.51 IC2.2 | 8.49,46.28 8.97,45.8 | 8.97,45.8 10,44.77 10,39.37 9.53,38.89 8.26,38.89 IC2.14 | 8.49,46.28 8.26,46.04 IC2.3 | 9.05,47.15 9.05,45.88 8.97,45.8 | 9.05,47.15 22.23,47.15 B23.P$4 B23ALT.P$4 30,47.15 30,49.37 31.27,50.64 42.39,50.64 | 42.39,50.64 42.39,53.34 C6.2 | 42.39,50.64 45.09,47.94 45.09,46.99 B24ALT.P$4 | C16.2 93.03,53.34 93.03,51.44 90.96,49.37 90.96,46.99 B27ALT.P$4 B27.P$4 B26ALT.P$4 75.56,46.99 75.56,48.1 C8.2 72.23,51.59 71.28,52.55 v69.37,52.55 67.94,51.12 IC3.3 | 60.8,48.42 60.8,47.31 60.48,46.99 B25ALT.P$4 B25.P$4 | 60.8,48.42 60.8,50.8 IC3.14 | 66.99,57.78 66.36,57.78 66.04,57.47 66.04,56.83 IC3.23 | 66.99,57.78 67.31,57.47 67.31,56.83 IC3.25 | IC3.5 66.67,50.96 67.15,50.96 IC3.4 67.47,50.96 67.63,50.96 | 67.63,50.96 67.94,50.96 | 67.94,50.96 IC3.3 | 67.94,50.96 68.58,50.96 IC3.2 | v66.99,57.94 66.99,57.78 | B26.P$4 68.1,46.99 68.1,50.8 IC3.3 | 60.8,48.42 65.25,48.42 67.63,50.8 67.63,50.96 | C17.2 123.51,90.17 123.51,88.27 121.44,86.2 121.44,83.82 B6ALT.P$4 B5ALT1.P$4 | B6ALT1.P$4 B7ALT.P$4 136.68,83.82 139.22,81.28 139.38,81.25 144.12,81.25 SERIAL.1 144.38,81.25 145.62,82.5 147.38,82.5 152.25,77.62 153.62,77.62 153.67,77.6 | 147.32,46.99 B31ALT.P$4 B32.P$4 B32ALT.P$4 167,46.99 167,47.94 164.31,50.64 164.31,50.96 | 147.32,46.99 B31.P$4 | 164.31,50.96 164.31,52.07 C18.2 | B9ALT2.P$4 188.75,46.99 | 188.75,46.99 B7ALT1.P$4 | 164.15,50.96 164.31,50.96 | 105.54,60.48 104.46,60.48 104.14,60.17 104.14,59.37 IC7.15 | IC8.5 128.11,54.45 128.75,54.45 IC8.4 | IC8.3 129.38,54.45 128.91,54.45 IC8.4
  Bottom 0.406: 128.67,59.61 128.75,59.69 128.75,60.17 IC8.25 | 128.67,59.61 128.43,59.37 127.79,59.37 127.48,59.69 127.48,60.17 IC8.23 | 128.75,56.36 128.75,59.53 128.67,59.61 | 128.75,56.36 128.75,54.61 IC8.4 | IC8.4 128.91,54.29 129.7,53.5 130.33,53.5 130.81,53.98 130.81,54.29 IC8.1 130.81,54.45 133.67,54.45 133.99,54.13 C15.2 133.99,53.98 136.53,51.44 136.53,46.99 B30ALT.P$4 | B30.P$4 128.91,46.99 128.91,54.13 IC8.4 | B28ALT.P$4 B28.P$4 | B28ALT.P$4 B29.P$4 B29ALT.P$4 121.44,46.99 121.44,51.91 122.24,52.7 122.24,54.45 IC8.14 122.24,54.61 122.24,55.72 122.87,56.36 128.75,56.36 | 105.7,60.99 98.58,68.1 98.58,68.58 B16.P$4 | 188.44,26.83 188.44,30.48 C19.2 188.44,30.64 188.83,31.04 | 188.44,26.83 189.87,25.4 B22.P$4 | 188.83,31.04 190.82,33.02 U$51.P$1 | C7.2 142.72,30.48 142.72,26.83 144.15,25.4 B19.P$4 B18ALT.P$4 | 188.44,26.83 176.21,26.83 174.78,25.4 B21.P$4 | 1.75,43.97 2.22,43.97 IC2.23 | 1.75,43.97 1.27,44.45 1.27,44.93 1.59,45.24 | 1.59,45.24 2.22,45.24 IC2.25 | IC1.17 3.97,61.75 3.97,61.28 IC1.16 3.81,61.28 3.17,61.28 1.27,59.37 1.27,45.72 1.59,45.4 1.59,45.24 | 0.79,26.75 0.79,17.78 U$28.P$1 | 0.79,26.75 0.79,43.18 1.59,43.97 1.75,43.97 | C4.2 40.32,30.48 37.62,27.78 37.62,25.4 B2.P$4 | B2ALT.P$4 B3.P$4 B3ALT.P$4 B4.P$4 68.1,25.56 75.56,25.56 B4ALT.P$4 B10.P$4 B10ALT.P$4 90.96,25.4 90.96,27.78 93.03,29.84 93.03,30.48 C5.2 | 85.88,9.37 84.77,9.37 IC6.23 | 87.07,10.56 90.33,13.81 C14.2 | 87.07,10.56 85.88,9.37 | IC6.25 84.77,10.64 87,10.64 87.07,10.56 | 85.88,9.37 85.88,8.1 89.85,4.13 90.49,4.13 IC6.14 | C14.2 90.33,13.65 90.96,13.02 90.65,12.7 IC6.1 | 103.98,11.75 105.73,10 U$26.P$1 103.82,11.75 92.08,11.75
  Bottom 0.406: B11.P$4 B11ALT.P$4 B17.P$4 | v12.7,26.04 19.84,26.04 20,26.19 21.43,26.19 22.23,25.4 B1.P$4 | 3.97,26.04 PC2.- 3.62,26.75 0.79,26.75 | B17ALT.P$4 B18.P$4 | 188.75,46.99 188.75,31.11 188.83,31.04 | 92.08,11.75 91.6,11.27 90.65,11.27 IC6.3 | 92.08,11.75 92.08,12.22 90.49,13.81 C14.2 | 147.32,46.99 147.32,54.61 PC1.-
GPA0  (via drill 0.41)
  Top 0.203: v35.88,81.12 37.15,79.85 39.21,79.85 v40.01,79.06 | v42.39,82.87 47.15,82.87 48.1,83.82 B8ALT.P$5 B8.P$5
  Bottom 0.203: v35.88,81.12 32.7,81.12 27.94,76.36 25.4,76.36 19.05,70.01 10.79,70.01 5.24,64.45 4.13,64.45 IC1.21 | v40.01,79.06 40.01,79.38 41.27,80.64 41.27,81.76 v42.39,82.87
GPA1  (via drill 0.41)
  Top 0.203: v2.7,65.25 2.7,65.72 3.97,66.99 v3.97,69.85 | v12.54,76.99 12.7,76.83 16.99,76.83 17.3,76.52 21.27,76.52 21.91,77.15 24.92,77.15 25.24,76.83 30.96,76.83 33.02,78.9 v35.88,78.9 | v38.73,83.82 B7.P$5 47.47,83.82 48.9,85.25 57.78,85.25 v59.53,87 | v176.5,48.12 v165.5,59.12 165.5,69.38 v142.88,92
  Bottom 0.203: v2.7,65.25 3.97,65.25 IC1.22 | v3.97,69.85 5.4,69.85 v12.54,76.99 | v35.88,78.9 37.15,80.17 37.62,80.17 38.73,81.28 v38.73,83.82 | B7ALT1.P$5 190.02,39.37 190.98,40.32 190.98,47.31 190.18,48.1 176.53,48.1 v176.5,48.12 | v59.53,87 64.45,91.92 64.5,92 v142.88,92 | v165.5,59.12 158.62,59.12 145.5,72.25 145.5,76.62 144.75,77.38 143.88,77.38 142.75,76.25 136.62,76.25 B7ALT.P$5
GPA2  (via drill 0.41)
  Top 0.203: B6ALT1.P$5 B6ALT.P$5 116.68,76.2 113.03,79.85 v113.03,80.8 | v9.84,70.01 12.22,70.01 13.49,71.28 v16.51,71.28 | B6.P$5 v24.29,76.2 | v46.35,81.28 v56.04,81.28
  Bottom 0.203: v9.84,70.01 9.84,69.69 6.03,65.88 4.13,65.88 IC1.23 | v16.51,71.28 19.37,71.28 v24.29,76.2 | v113.03,80.8 109.86,80.8 109.54,81.12 60.01,81.12 59.85,80.96 56.36,80.96 v56.04,81.28 | v46.35,81.28 44.93,79.85 41.59,79.85 40.64,78.9 40.64,78.74 38.1,76.2 B6.P$5
GPA3  (via drill 0.41)
  Top 0.203: v90.65,62.87 93.66,65.88 97.16,65.88 106.05,74.77 106.05,76.2 B5ALT.P$5 | v78.74,49.69 78.74,49.37 79.69,48.42 81.92,48.42 82.23,48.1 82.23,45.24 78.58,41.59 60.96,41.59 60.8,41.43 56.52,41.43 56.36,41.59 45.09,41.59 v44.93,41.43 | v31.11,46.2 31.11,47.15 26.67,51.59 25.56,51.59 10.95,66.2 9.53,66.2 7.62,68.1 v7.62,68.42
  Bottom 0.203: B5ALT1.P$5 B5ALT.P$5 | 7.78,68.26 9.21,69.69 9.21,72.87 11.11,74.77 12.22,74.77 13.02,73.98 20,73.98 22.23,76.2 B5.P$5 | 7.78,68.26 6.03,66.52 4.13,66.52 IC1.24 | v90.65,62.87 86.2,58.42 86.2,57.15 v78.74,49.69 | v44.93,41.43 43.81,41.43 42.86,42.39 42.55,42.39 41.75,43.18 41.75,43.5 40.96,44.29 38.42,44.29 38.26,44.13 33.5,44.13 32.86,44.77 32.54,44.77 v31.11,46.2 | 7.78,68.26 v7.62,68.42
GPA4  (via drill 0.41)
  Top 0.203: v2.38,66.99 2.38,66.67 0.64,64.93 0.64,36.35 v3.02,33.97 | B1.P$5 B1ALT.P$5
  Bottom 0.203: v2.38,66.99 3.97,66.99 IC1.25 | 17,20 20,20 22.23,17.78 B1.P$5 | 17,20 16.99,20 | 17,20 16.75,20 7,29.75 3,29.75 2.75,30 2.75,33.62 3,33.88 v3.02,33.97
GPA4S  (via drill 0.41)
  Top 0.203: v12.38,93.34 12.38,87.63 13.18,86.84 13.18,83.19 SSW1.2
  Bottom 0.203: v12.38,93.34 13.49,93.34 IC4.25
GPA5  (via drill 0.41)
  Top 0.203: v2.7,63.34 2.7,59.37 v4.76,57.31 | v8.1,55.56 8.1,55.24 14.45,48.9 v14.45,45.09 | v14.45,39.05 20.32,33.18 v20.32,25.4 | B2.P$5 B2ALT.P$5
  Bottom 0.203: v2.7,63.34 1.75,64.29 1.75,67.31 2.06,67.63 3.97,67.63 IC1.26 | v4.76,57.31 6.35,57.31 v8.1,55.56 | v14.45,39.05 v14.45,45.09 | v20.32,25.4 20.8,25.4 23.5,22.7 30.48,22.7 33.18,20 35.24,20 37.47,17.78 B2.P$5
GPA6  (via drill 0.41)
  Top 0.203: v5.71,68.42 6.67,68.42 25.56,49.53 25.56,49.21 30.48,44.29 33.97,44.29 40.8,37.47 40.8,35.56 48.42,27.94 48.42,25.4 52.7,21.11 52.7,17.78 B3.P$5 B3ALT.P$5
  Bottom 0.203: v5.71,68.42 4.13,68.42 IC1.27
GPA7  (via drill 0.41)
  Top 0.203: v6.35,67.79 6.67,67.79 23.02,51.44 23.02,49.21 25.08,47.15 26.04,47.15 v29.21,43.97 | v43.18,35.72 44.13,35.72 54.77,25.08 56.36,25.08 62.55,18.89 62.55,18.57 63.34,17.78 B4.P$5 B4ALT.P$5
  Bottom 0.203: v6.35,67.79 6.35,68.74 6.03,69.06 4.13,69.06 IC1.28 | v29.21,43.97 29.21,43.02 34.29,37.94 36.83,37.94 39.05,35.72 v43.18,35.72
GPA8  (via drill 0.41)
  Top 0.203: v16.99,68.9 19.21,68.9 28.42,59.69 89.53,59.69 90.81,60.96 B16ALT.P$5 B16.P$5
  Bottom 0.203: v16.99,68.9 11.27,68.9 IC1.1
GPA9  (via drill 0.41)
  Top 0.203: v16.35,68.26 19.21,68.26 28.26,59.21 32.07,59.21 33.97,57.31 v44.45,57.31 | v47.47,60.33 47.94,60.33 48.1,60.17 59.53,60.17 60.33,60.96 B15ALT.P$5 B15.P$5
  Bottom 0.203: v16.35,68.26 11.27,68.26 IC1.2 | v47.47,60.33 v44.45,57.31
GPA10  (via drill 0.41)
  Top 0.203: v12.54,67.63 12.54,66.67 16.83,62.39 16.83,61.75 22.86,55.72 v32.23,55.72 | B14ALT.P$5 43.66,60.96 43.18,60.48 38.1,60.48 37.62,60.96 B14.P$5
  Bottom 0.203: v12.54,67.63 11.27,67.63 IC1.3 | v32.23,55.72 33.02,55.72 37.47,60.17 37.47,60.96 B14.P$5
GPA11  (via drill 0.41)
  Top 0.203: B13ALT.P$5 B13ALT1.P$5 69.37,60.96 v64.61,65.72 | v14.13,66.99 17.94,63.18 20,63.18 22.23,60.96 B13.P$5 | v41.91,66.99 41.27,66.36 v22.7,66.36
  Bottom 0.203: v14.13,66.99 11.27,66.99 IC1.4 | v64.61,65.72 63.98,65.72 63.34,66.36 58.26,66.36 56.36,68.26 50.64,68.26 49.37,66.99 v41.91,66.99 | v22.7,66.36 20.8,66.36 17.62,63.18 17.3,63.18 16.83,62.71 16.83,61.75 17.62,60.96 B13.P$5
GPA12  (via drill 0.41)
  Top 0.203: v23.02,73.03 23.02,73.98 24.45,75.41 36.99,75.41 37.62,74.77 56.2,74.77 63.02,81.6 64.29,81.6 66.52,83.82 B9ALT.P$5 B9.P$5 | B9ALT2.P$5 174.62,39.37 174.62,40.16 170.02,44.77 167.16,44.77 164.94,46.99 164.88,47 164.88,69.12 v143.88,90.12
  Bottom 0.203: v23.02,73.03 22.7,73.03 19.21,69.53 18.57,69.53 15.4,66.36 11.27,66.36 IC1.5 | B9.P$5 78.9,83.82 86.52,91.44 86.5,91.5 131.25,91.5 132.62,90.12 v143.88,90.12
GPA13  (via drill 0.41)
  Top 0.203: v8.73,64.77 9.05,64.77 22.38,51.44 v22.38,51.12 | v28.1,51.12 28.1,50.8 31.91,46.99 31.91,45.4 32.54,44.77 35.08,44.77 41.91,37.94 42.55,37.94 50.96,29.53 52.23,29.53 52.7,29.05 67.31,29.05 71.28,25.08 72.55,25.08 77.63,20 80.96,20 83.19,17.78 B10.P$5 83.98,17.78 86.2,15.56 86.2,15.24 88.42,13.02 89.06,13.02 90.81,14.76 90.81,17.78 B10ALT.P$5
  Bottom 0.203: v8.73,64.77 9.68,65.72 11.11,65.72 IC1.6 | v28.1,51.12 v22.38,51.12
GPA14  (via drill 0.41)
  Top 0.203: v12.54,65.72 12.54,65.41 25.88,52.07 30.64,52.07 33.18,49.53 33.18,49.21 40.8,41.59 41.12,41.59 41.91,40.8 41.91,40.48 52.86,29.53 97.31,29.53 101.76,25.08 102.08,25.08 106.05,21.11 106.05,17.78 | 106.05,17.78 B11.P$5 | 106.05,17.78 B11ALT.P$5
  Bottom 0.203: v12.54,65.72 12.06,65.25 11.27,65.25 IC1.7
GPA15  (via drill 0.41)
  Top 0.203: v8.41,63.82 9.05,63.82 v13.81,59.05 | v26.04,59.53 27.3,59.53 28.1,58.74 31.91,58.74 33.81,56.83 43.97,56.83 44.13,56.67 v46.67,56.67 | v48.42,60.8 58.1,60.8 63.66,66.36 68.74,66.36 72.39,70.01 74.93,70.01 77.47,72.55 82.55,72.55 86.2,76.2 B12ALT.P$5 B12.P$5
  Bottom 0.203: v8.41,63.82 8.73,63.82 9.37,64.45 11.11,64.45 IC1.8 | v13.81,59.05 23.34,59.05 23.81,59.53 v26.04,59.53 | v46.67,56.67 48.42,58.42 v48.42,60.8
GPA16  (via drill 0.41)
  Top 0.203: v104.46,50.64 v108.27,54.45 | v104.46,47.78 104.46,45.56 102.87,43.97 102.23,43.97 101.92,44.29 101.28,44.29 93.82,36.83 93.82,36.51 90.49,33.18 49.85,33.18 48.1,34.92 48.1,37.15 45.88,39.37 B24ALT.P$5 | v45.24,30.16 44.61,30.16 37.62,37.15 37.62,39.37 B24.P$5
  Bottom 0.203: v108.27,54.45 108.11,54.61 108.11,59.21 IC7.21 | v104.46,47.78 v104.46,50.64 | v45.24,30.16 45.24,39.37 B24ALT.P$5
GPA17  (via drill 0.41)
  Top 0.203: v108.74,57.15 101.44,49.85 101.44,48.58 99.38,46.51 99.38,43.34 93.98,37.94 83.19,37.94 79.06,33.81 v50.16,33.81 | v45.88,29.53 43.02,29.53 33.18,39.37 B23ALT.P$5 B23.P$5
  Bottom 0.203: v108.74,57.15 108.74,59.21 IC7.22 | v45.88,29.53 v50.16,33.81
GPA18  (via drill 0.41)
  Top 0.203: v120.81,62.23 124.94,62.23 136.05,51.12 149.07,51.12 153.83,46.35 153.83,42.86 155.1,41.59 155.89,41.59 159.54,37.94 165.1,37.94 185.26,17.78 B22.P$5
  Bottom 0.203: v120.81,62.23 111.6,62.23 109.54,60.17 109.54,59.37 IC7.23
GPA19  (via drill 0.41)
  Top 0.203: v118.59,60.96 122.4,60.96 132.24,51.12 132.24,48.26 v134.62,45.88 | 156.25,37.94 157.48,37.94 168.91,26.51 174.94,26.51 176.05,25.4 176.05,19.05 174.78,17.78 B21.P$5 | 156.25,37.94 156.21,37.94 | 156.25,37.94 156.25,38 151.75,42.5 151.75,43.75 151.62,43.88 v151.61,43.97
  Bottom 0.203: v118.59,60.96 111.12,60.96 110.17,60.01 110.17,59.37 IC7.24 | v134.62,45.88 136.21,44.29 151.29,44.29 v151.61,43.97
GPA20  (via drill 0.41)
  Top 0.203: v110.81,57.63 110.81,50.64 112.71,48.74 112.71,18.73 113.67,17.78 B17.P$5 B17ALT.P$5
  Bottom 0.203: v110.81,57.63 110.81,59.21 IC7.25
GPA21  (via drill 0.41)
  Top 0.203: v112.08,56.67 112.71,56.67 117.63,51.75 v122.4,51.75 | v124.62,46.99 127.16,44.45 127.16,40.01 127.95,39.21 127.95,38.58 v128.11,38.42 | v128.11,32.54 128.11,26.04 127.95,25.88 127.95,24.13 128.91,23.18 128.91,17.78 B18.P$5 B18ALT.P$5
  Bottom 0.203: v112.08,56.67 111.44,57.31 111.44,59.21 IC7.26 | v122.4,51.75 124.62,49.53 v124.62,46.99 | v128.11,32.54 v128.11,38.42
GPA22  (via drill 0.41)
  Top 0.203: v112.08,57.63 111.44,56.99 111.44,52.23 117,46.67 118.27,46.67 123.51,41.43 123.51,40.16 125.73,37.94 127,37.94 139.86,25.08 140.18,25.08 144.15,21.11 144.15,17.78 B19.P$5 B19ALT.P$5
  Bottom 0.203: v112.08,57.63 112.08,59.21 IC7.27
GPA23  (via drill 0.41)
  Top 0.203: v113.82,53.66 113.82,52.7 117,49.53 117,48.58 123.98,41.59 124.94,41.59 127.48,39.05 127.48,38.1 136.53,29.05 141.29,29.05 143.19,27.15 143.19,24.92 144.94,23.18 150.81,23.18 153.99,20 153.99,18.57 154.78,17.78 B20.P$5 B20ALT.P$5
  Bottom 0.203: v113.82,53.66 113.98,53.82 113.98,57.31 112.71,58.58 112.71,59.21 IC7.28
GPA24  (via drill 0.41)
  Top 0.203: v119.22,61.59 121.13,63.5 124.3,63.5 136.21,51.59 150.18,51.59 155.1,46.67 155.42,46.67 155.5,46.62 155.88,46.25 155.88,45.75 158.88,42.75 159.38,42.75 159.38,42.7 159.38,39.37 B32.P$5 B32ALT.P$5
  Bottom 0.203: v119.22,61.59 119.22,58.1 113.19,52.07 112.71,52.07 IC7.1
GPA25  (via drill 0.41)
  Top 0.203: v116.84,50.64 126.36,50.64 127.32,51.59 127.95,51.59 129.7,49.85 129.7,49.21 132.24,46.67 132.56,46.67 134.62,44.61 134.62,41.12 135.41,40.32 138.59,40.32 139.54,39.37 B31.P$5 B31ALT.P$5
  Bottom 0.203: v116.84,50.64 112.71,50.64 112.08,51.28 112.08,51.91 IC7.2
GPA26  (via drill 0.41)
  Top 0.203: v112.87,54.29 114.14,54.29 117.32,51.12 125.25,51.12 v125.41,51.28 | v127.64,49.05 127.64,40.64 128.91,39.37 B30.P$5 B30ALT.P$5
  Bottom 0.203: v112.87,54.29 111.44,52.86 111.44,52.07 IC7.3 | v127.64,49.05 v125.41,51.28
GPA27  (via drill 0.41)
  Top 0.203: v113.67,48.26 113.82,48.26 114.78,47.31 114.78,40.32 113.82,39.37 | 113.82,39.37 B29ALT.P$5 | 113.82,39.37 B29.P$5
  Bottom 0.203: v113.67,48.26 110.81,51.12 110.81,51.91 IC7.4
GPA28  (via drill 0.41)
  Top 0.203: v110.01,53.34 109.7,53.34 106.68,50.32 105.73,50.32 102.55,47.15 v102.55,44.61 | v98.74,44.61 98.74,43.34 93.82,38.42 83.03,38.42 80.33,35.72 61.91,35.72 60.48,37.15 60.48,39.37 B25ALT.P$5 B25.P$5
  Bottom 0.203: v110.01,53.34 110.01,52.07 IC7.5 | v98.74,44.61 v102.55,44.61
GPA29  (via drill 0.41)
  Top 0.203: v109.38,56.52 109.38,57.47 109.06,57.78 104.93,57.78 95.57,48.42 87,48.42 79.69,41.12 79.69,40.16 78.9,39.37 B26ALT.P$5 B26.P$5
  Bottom 0.203: v109.38,56.52 109.38,52.07 IC7.6
GPA30  (via drill 0.41)
  Top 0.203: v108.74,53.34 108.11,53.34 101.44,46.67 100.49,46.67 v100.01,46.2 | v98.74,45.56 96.84,43.66 96.84,42.07 94.14,39.37 B27ALT.P$5 B27.P$5
  Bottom 0.203: v108.74,53.34 108.74,52.07 IC7.7 | v100.01,46.2 99.38,46.2 v98.74,45.56
GPA31  (via drill 0.41)
  Top 0.203: v109.06,47.78 109.06,46.99 107.47,45.4 107.47,40.64 106.2,39.37 B28ALT.P$5 B28.P$5
  Bottom 0.203: v109.06,47.78 109.06,49.85 108.27,50.64 108.27,51.91 IC7.8
GPB4  (via drill 0.41)
  Top 0.203: v19.53,92.87 19.53,83.5 25.08,77.95 25.56,77.95 SSW1.8
  Bottom 0.203: v19.53,92.87 20.8,92.87 IC4.5
I2C_SCL  (via drill 0.41)
  Top 0.203: 134.3,59.21 134.25,59.21 | 134.25,59.21 v129.54,59.21 129.22,59.21 124.14,64.29 v121.6,64.29 | v68.42,54.77 86.36,54.77 87.47,53.66 98.27,53.66 v99.22,54.61 | v103.5,61.59 v103.5,64.45 | v7.46,25.24 21.43,11.27 v83.66,11.27 v86.2,13.81 | 2.38,42.07 v2.38,36.67 | 3.49,45.56 v3.49,45.88 v3.49,56.99 1.91,58.58 v1.91,61.12 | v14.13,84.45 v18.89,89.22 | v106.05,49.69 106.36,49.69 107.63,48.42 109.38,48.42 112.08,45.72 112.08,36.99 105.89,30.8 v90.33,30.8 | v88.74,28.89 88.74,24.77 87.47,23.5 v87.47,16.51 | v12.54,52.07 v8.1,56.52 | v12.54,47.94 12.54,47.62 11.27,46.35 v11.27,45.09 | v8.57,38.1 8.57,36.99 8.26,36.67 v8.26,30.48 | v9.21,29.53 8.89,29.53 v6.19,26.83 | v155.88,74.75 150.62,74.75 150.19,75.19 | 150.19,75.19 146.88,78.5 SERIAL.4 | 150.19,75.19 134.25,59.25 134.25,59.21
  Bottom 0.203: v129.54,59.21 129.54,60.17 IC8.26 | v68.42,54.77 67.79,55.4 67.79,56.04 67.94,56.2 67.94,56.67 IC3.26 | 103.5,54.61 103.66,54.61 105.41,52.86 105.41,52.07 IC7.12 105.57,51.91 105.57,50.16 v106.05,49.69 | 103.5,54.61 v99.22,54.61 | v121.6,64.29 121.6,66.04 118.43,69.22 108.27,69.22 v103.5,64.45 | 103.5,54.61 v103.5,61.59 | v83.66,11.27 84.61,11.27 IC6.26 | v7.46,25.24 7.46,25.56 v6.19,26.83 6.12,26.88 6.12,27.25 4.75,28.62 3.5,28.62 2.38,29.75 2.38,36.62 v2.38,36.67 | IC2.26 2.38,45.88 v3.49,45.88 | v3.49,56.99 5.56,59.05 | 5.56,59.05 8.26,61.75 11.11,61.75 IC1.12 | v18.89,89.22 19.84,88.27 20.8,88.27 IC4.12 | v14.13,84.45 12.7,84.45 3.97,75.72 3.97,74.45 0.64,71.12 0.64,62.39 v1.91,61.12 | v90.33,30.8 90.33,30.48 v88.74,28.89 | v87.47,16.51 86.2,15.24 v86.2,13.81 | v8.1,56.52 5.56,59.05 | v12.54,47.94 v12.54,52.07 | v11.27,45.09 11.27,40.16 11.43,40.01 11.43,39.37 10.16,38.1 v8.57,38.1 | v9.21,29.53 v8.26,30.48 | v155.88,74.75 155.88,73.75 U$94.P$4
I2C_SDA  (via drill 0.41)
  Top 0.203: v4.13,50.64 v4.13,46.51 4.76,45.88 5.71,45.88 6.03,46.2 6.03,61.59 5.08,62.55 5.08,64.77 | v18.89,88.27 18.89,85.25 5.08,71.44 5.08,64.77 | 135.57,61.44 v130.02,61.44 130,61.5 v130,71.75 | v89.22,14.13 89.22,28.1 v89.53,28.42 | v106.84,42.39 106.84,44.77 105.09,46.51 v105.09,48.74 | 70.96,55.72 87.95,55.72 89.06,54.61 v98.27,54.61 | 70.96,55.72 v68.42,55.72 | v108.27,71.75 108.27,70.17 v101.44,63.34 | 5.08,64.77 6.51,64.77 19.37,51.91 v20.95,51.91 | v31.27,52.39 35.88,52.39 36.67,51.59 v53.66,51.59 | v59.05,53.5 63.82,53.5 64.29,53.98 v66.83,53.98 | 70.96,55.72 v70.96,55.4
  Bottom 0.203: v4.13,46.51 2.38,46.51 IC2.27 | v4.13,50.64 10.16,56.67 10.16,60.8 10.48,61.12 11.11,61.12 IC1.13 | v18.89,88.27 19.53,87.63 20.8,87.63 IC4.13 | v130.02,61.44 130.02,60.33 IC8.27 | v89.22,14.13 87,11.91 84.77,11.91 IC6.27 | v89.53,28.42 89.53,29.05 98.58,38.1 106.2,38.1 107.16,39.05 107.16,42.07 v106.84,42.39 | v105.09,48.74 105.09,51.12 104.93,51.28 104.93,51.91 IC7.13 104.78,52.07 104.78,52.86 104.62,53.02 99.85,53.02 v98.27,54.61 101.44,57.78 v101.44,63.34 | v68.42,55.72 68.58,55.88 68.58,56.67 IC3.27 | v108.27,71.75 v130,71.75 | v130,71.75 130.33,71.75 137.16,78.58 137.25,78.62 144.25,78.62 SERIAL.3 144.38,78.5 145.5,77.38 147.25,77.38 151.75,72.88 155.25,72.88 155.5,73.12 155.5,73.62 U$94.P$3 | v20.95,51.91 30.8,51.91 v31.27,52.39 | v53.66,51.59 57.15,51.59 v59.05,53.5 | v66.83,53.98 67.31,53.98 67.94,53.34 68.9,53.34 v70.96,55.4 | v130,71.75
L0
  Top 0.203: B1.P$2 B1ALT.P$2
  Bottom 0.203: B1.P$2 R20.1
L1
  Top 0.203: B1.P$3 B1ALT.P$3
  Bottom 0.203: B1.P$3 R19.1
L2
  Top 0.203: B2.P$2 B2ALT.P$2
  Bottom 0.203: B2.P$2 32.86,23.97 31.59,23.97 R18.1
L3
  Top 0.203: B2.P$3 B2ALT.P$3
  Bottom 0.203: B2.P$3 32.86,19.21 31.59,19.21 R17.1
L4
  Bottom 0.203: R16.1 46.83,23.97 48.1,23.97 B3.P$2 B3ALT.P$2
L5
  Bottom 0.203: R15.1 46.83,19.21 48.1,19.21 B3.P$3 B3ALT.P$3
L6
  Bottom 0.203: B4ALT.P$2 70.96,23.97 69.69,23.97 R14.1 69.53,23.81 68.74,23.02 67.31,23.02 66.2,24.13 B4.P$2
L7
  Top 0.203: B4ALT.P$3 B4.P$3
  Bottom 0.203: B4ALT.P$3 70.96,19.21 69.69,19.21 R13.1
L8  (via drill 0.41)
  Top 0.203: B5ALT1.P$2 B5ALT.P$2 | v23.02,82.55 23.34,82.55 26.04,85.25 26.99,85.25 27.46,85.72 v33.02,85.72 | v33.97,86.68 34.45,86.2 37.15,86.2 38.89,87.95 55.24,87.95 55.4,88.11 v96.04,88.11
  Bottom 0.203: B5.P$2 R12.1 19.37,82.55 20.16,81.76 22.23,81.76 v23.02,82.55 | v33.97,86.68 v33.02,85.72 | B5ALT.P$2 v96.04,88.11
L9  (via drill 0.41)
  Top 0.203: B5.P$3 17.78,78.58 18.89,79.69 v18.89,83.66 | v20.32,83.66 20.32,85.57 25.4,90.65 41.59,90.65 41.91,90.33 86.36,90.33 86.52,90.17 v87.47,90.17 | B5ALT.P$3 v95.57,83.5
  Bottom 0.203: B5.P$3 R11.1 | B5ALT1.P$3 B5ALT.P$3 | v20.32,83.66 v18.89,83.66 | v87.47,90.17 94.14,83.5 v95.57,83.5
L10
  Top 0.203: B6ALT1.P$2 117,82.55 | B6.P$2 35.24,82.55 36.51,83.82 36.51,84.93 39.05,87.47 59.05,87.47 59.21,87.63 95.57,87.63 95.73,87.47 112.08,87.47 117,82.55 | 117,82.55 B6ALT.P$2
  Bottom 0.203: B6.P$2 33.18,82.71 34.45,82.71 R10.1
L11  (via drill 0.41)
  Top 0.203: B6ALT1.P$3 B6ALT.P$3 115.73,78.58 115.73,83.19 113.98,84.93 64.45,84.93 58.42,78.9 v57.78,78.9 | v42.86,77.47 B6.P$3
  Bottom 0.203: B6.P$3 33.18,77.31 34.45,77.31 R9.1 | v42.86,77.47 46.83,77.47 48.26,78.9 v57.78,78.9
L12  (via drill 0.41)
  Top 0.203: B7.P$2 54.45,77.47 55.88,78.9 56.2,78.9 v63.5,86.2 | v66.2,89.22 86.2,89.22 86.36,89.06 95.41,89.06 95.57,89.22 125.57,89.22 132.08,82.71 B7ALT.P$2
  Bottom 0.203: B7.P$2 48.42,77.63 49.69,77.63 R8.1 | 137.16,82.55 B7ALT.P$2 132,82.62 128.75,82.62 128,83.38 128,84.25 128.62,84.88 153.75,84.88 166.12,72.5 166.12,54.12 174.5,45.75 185.38,45.75 B7ALT1.P$2 | v63.5,86.2 63.5,86.52 v66.2,89.22
L13  (via drill 0.41)
  Top 0.203: B7ALT1.P$3 184.31,41.75 184.31,45.72 184.25,45.75 177.38,45.75 v165.5,57.62 | v54.45,82.55 B7.P$3 | v63.18,88.74 65.72,88.74 65.88,88.58 95.57,88.58 95.73,88.74 125.41,88.74 130.97,83.19 130.97,78.58 B7ALT.P$3 133.19,77.47 138.43,72.23 138.5,72.25 138.62,72.12 v143.38,72.12
  Bottom 0.203: B7.P$3 48.42,82.39 49.69,82.39 R7.1 | v54.45,82.55 57.15,85.25 59.69,85.25 v63.18,88.74 | v165.5,57.62 157.88,57.62 v143.38,72.12
L14
  Bottom 0.203: B8ALT.P$2 56.04,77.63 57.31,77.63 R6.1 57.47,77.63 58.42,78.58 59.69,78.58 60.8,77.47 B8.P$2
L15
  Bottom 0.203: B8ALT.P$3 56.04,82.39 57.31,82.39 R5.1 57.47,82.23 58.26,81.44 59.69,81.44 60.8,82.55 B8.P$3
L16  (via drill 0.41)
  Top 0.203: B9ALT2.P$2 166.85,45.72 165.58,46.99 v165.58,47.78
  Bottom 0.203: B9ALT.P$2 71.28,77.63 72.55,77.63 R32.1 72.71,77.79 73.5,78.58 75.09,78.58 76.2,77.47 B9.P$2 80.01,78.74 86.52,78.74 90.01,75.25 102.71,75.25 106.84,71.12 108.58,71.12 108.74,71.28 118.43,71.28 122.71,66.99 122.71,66.04 124.46,64.29 124.5,64.25 130.75,64.25 134.88,60.12 137.75,60.12 138.38,59.5 148.38,59.5 160,47.88 160.02,47.78 v165.58,47.78
L17  (via drill 0.41)
  Top 0.203: B9ALT.P$3 B9.P$3 | B9ALT2.P$3 170.18,41.12 162.4,48.9 162.38,48.88 162.38,70.75 v142.38,90.75 | v86.84,90.81 139.06,90.81 v139.12,90.75
  Bottom 0.203: B9ALT.P$3 71.28,82.39 72.55,82.39 R31.1 | v86.84,90.81 78.74,82.71 B9.P$3 | v139.12,90.75 v142.38,90.75
L18
  Bottom 0.203: R30.1 77.31,23.97 78.58,23.97 B10.P$2 B10ALT.P$2
L19
  Bottom 0.203: R29.1 77.31,19.21 78.58,19.21 B10.P$3 B10ALT.P$3
L20
  Top 0.203: B11.P$2 B11ALT.P$2
  Bottom 0.203: B11.P$2 93.82,23.97 92.55,23.97 R28.1
L21
  Bottom 0.203: R27.1 92.55,19.21 93.82,19.21 B11.P$3 B11ALT.P$3
L22
  Top 0.203: B12ALT.P$2 B12.P$2
  Bottom 0.203: B12ALT.P$2 R57.1
L23
  Top 0.203: B12ALT.P$3 B12.P$3
  Bottom 0.203: B12ALT.P$3 R56.1
L24  (via drill 0.41)
  Top 0.203: B13ALT.P$2 B13ALT1.P$2 | v50.16,70.01 v22.07,70.01
  Bottom 0.203: B13.P$2 R63.1 19.37,67.31 v22.07,70.01 | v50.16,70.01 65.09,70.01 67.79,67.31 B13ALT1.P$2
L25  (via drill 0.41)
  Top 0.203: B13ALT.P$3 B13ALT1.P$3 68.9,62.23 68.26,62.87 68.26,63.02 v67.94,63.34 | B13.P$3 18.89,62.23 v24.77,56.36 | v59.53,63.18 v46.04,63.18
  Bottom 0.203: B13.P$3 R62.1 | v24.77,56.36 30.16,56.36 31.43,57.63 31.43,62.07 33.02,63.66 38.1,63.66 40.32,65.88 41.91,65.88 44.61,63.18 v46.04,63.18 | v59.53,63.18 67.79,63.18 v67.94,63.34
L26
  Top 0.203: B14.P$2 B14ALT.P$2
  Bottom 0.203: B14.P$2 R61.1
L27
  Top 0.203: B14.P$3 B14ALT.P$3
  Bottom 0.203: B14.P$3 R60.1
L28
  Top 0.203: B15ALT.P$2 B15.P$2
  Bottom 0.203: B15ALT.P$2 R59.1
L29
  Bottom 0.203: R58.1 B15ALT.P$3 B15.P$3
L30
  Top 0.203: B16ALT.P$2 B16.P$2
  Bottom 0.203: B16ALT.P$2 86.2,67.15 84.93,67.15 R65.1
L31
  Top 0.203: B16ALT.P$3 B16.P$3
  Bottom 0.203: B16ALT.P$3 86.2,62.39 84.93,62.39 R64.1
L32
  Bottom 0.203: B17ALT.P$2 116.68,23.97 115.41,23.97 R39.1 115.25,23.81 114.3,22.86 111.76,22.86 110.49,24.13 B17.P$2
L33
  Bottom 0.203: B17ALT.P$3 116.68,19.21 115.41,19.21 R38.1 115.25,19.37 114.46,20.16 113.03,20.16 111.92,19.05 B17.P$3
L34
  Bottom 0.203: B18ALT.P$2 131.92,23.97 130.65,23.97 R37.1 130.49,23.81 129.38,22.7 127.48,22.7 126.05,24.13 B18.P$2
L35
  Bottom 0.203: B18ALT.P$3 131.92,19.21 130.65,19.21 R36.1 130.49,19.37 129.7,20.16 128.27,20.16 127.16,19.05 B18.P$3
L36
  Bottom 0.203: R35.1 138.27,23.97 139.54,23.97 B19.P$2 B19ALT.P$2
L37
  Bottom 0.203: R34.1 138.27,19.21 139.54,19.21 B19.P$3 B19ALT.P$3
L38
  Top 0.203: B20.P$2 B20ALT.P$2
  Bottom 0.203: B20.P$2 154.78,23.97 153.51,23.97 R26.1
L39
  Top 0.203: B20.P$3 B20ALT.P$3
  Bottom 0.203: B20.P$3 154.78,19.21 153.51,19.21 R25.1
L40
  Bottom 0.203: B21.P$2 170.02,23.97 168.75,23.97 R24.1
L41
  Bottom 0.203: B21.P$3 170.02,19.21 168.75,19.21 R23.1
L42
  Bottom 0.203: B22.P$2 R22.1
L43
  Bottom 0.203: B22.P$3 R21.1
L44
  Top 0.203: B23ALT.P$2 B23.P$2
  Bottom 0.203: B23ALT.P$2 R4.1
L45
  Bottom 0.203: R3.1 B23ALT.P$3 B23.P$3
L46
  Bottom 0.203: B24ALT.P$2 40.48,45.56 39.21,45.56 R2.1 39.05,45.56 38.1,44.61 36.83,44.61 35.72,45.72 B24.P$2
L47
  Bottom 0.203: B24ALT.P$3 40.48,40.8 39.21,40.8 R1.1 39.05,40.96 38.26,41.75 36.83,41.75 35.72,40.64 B24.P$3
L48
  Top 0.203: B25ALT.P$2 B25.P$2
  Bottom 0.203: B25ALT.P$2 R55.1
L49
  Top 0.203: B25ALT.P$3 B25.P$3
  Bottom 0.203: B25ALT.P$3 R54.1
L50
  Top 0.203: B26ALT.P$2 B26.P$2
  Bottom 0.203: B26ALT.P$2 R53.1
L51
  Top 0.203: B26ALT.P$3 B26.P$3
  Bottom 0.203: B26ALT.P$3 R52.1
L52
  Bottom 0.203: R51.1 B27ALT.P$2 B27.P$2
L53
  Bottom 0.203: R50.1 B27ALT.P$3 B27.P$3
L54  (via drill 0.41)
  Top 0.203: v96.2,43.5 B28.P$2 | v104.14,43.97 v102.23,42.07
  Bottom 0.203: B28ALT.P$2 102.39,45.72 | 102.39,45.72 R49.1 | v96.2,43.5 97.79,43.5 99.22,42.07 v102.23,42.07 | 102.39,45.72 v104.14,43.97
L55
  Bottom 0.203: R48.1 B28ALT.P$3 B28.P$3
L56
  Bottom 0.203: R47.1 B29ALT.P$2 B29.P$2
L57
  Bottom 0.203: R46.1 B29ALT.P$3 B29.P$3
L58
  Bottom 0.203: B30ALT.P$2 131.92,45.56 130.65,45.56 R45.1 130.49,45.4 129.7,44.61 128.27,44.61 127.16,45.72 B30.P$2
L59
  Bottom 0.203: B30ALT.P$3 131.92,40.8 130.65,40.8 R44.1 130.49,40.96 128.91,42.55 127.95,42.55 126.05,40.64 B30.P$3
L60
  Top 0.203: B31.P$2 B31ALT.P$2
  Bottom 0.203: B31.P$2 139.54,45.56 138.27,45.56 R43.1
L61
  Top 0.203: B31.P$3 B31ALT.P$3
  Bottom 0.203: B31.P$3 139.54,40.8 138.27,40.8 R42.1
L62
  Bottom 0.203: R41.1 153.51,45.56 154.78,45.56 B32.P$2 155,45.75 155.25,46 160,46 160.25,45.75 162.5,45.75 B32ALT.P$2
L63
  Bottom 0.203: R40.1 153.51,40.8 154.78,40.8 B32.P$3 B32ALT.P$3
MOSI  (via drill 0.41)
  Top 0.203: v34.92,87.79 35.24,87.79 36.99,89.53 v39.69,89.53 | v38.42,92.39 138.11,92.39 138.12,92.38 139.88,92.38 150.75,81.5 150.75,81 149.62,79.88 146.38,79.88 145.5,79 145.5,75.62 146.75,74.38 146.75,73.62 SERIAL.8
  Bottom 0.203: v34.92,87.79 35.56,87.15 35.56,86.52 32.07,83.03 32.07,81.76 28.1,77.79 27.3,77.79 25.72,79.38 25.72,79.85 SSW1.6 | v39.69,89.53 39.69,92.08 39.37,92.39 v38.42,92.39 | U$94.P$8 157.88,73.62 157.88,73 157.38,72.5 147.88,72.5 146.88,73.5 SERIAL.8
N$2
  Bottom 0.203: IC6.13 90.65,4.92 134.3,4.92 147.48,18.1 150.65,18.1 151.76,19.21 R25.2
N$3  (via drill 0.41)
  Top 0.203: v59.85,30.16 102.71,30.16 107.16,25.72 v107.16,20.8
  Bottom 0.203: v59.85,30.16 51.75,38.26 51.75,48.1 54.29,50.64 56.83,50.64 59.05,52.86 61.28,52.86 62.71,51.44 62.71,50.96 IC3.11 | v107.16,20.8 102.23,20.8 101.6,20.16 91.76,20.16 90.96,19.37 R27.2
N$4  (via drill 0.41)
  Top 0.203: v9.21,39.69 9.21,36.99 8.89,36.67 v8.89,31.91 | v13.97,26.83 13.97,24.92 15.4,23.5 15.4,20 18.57,16.83 v31.27,16.83
  Bottom 0.203: v9.21,39.69 9.05,39.53 8.26,39.53 IC2.13 | v13.97,26.83 v8.89,31.91 | v31.27,16.83 65.56,16.83 67.94,19.21 R13.2
N$5  (via drill 0.41)
  Top 0.203: v9.21,40.64 16.35,40.64 19.05,37.94 27.94,37.94 39.53,26.35 44.61,26.35 44.77,26.51 v47.78,26.51 | v66.83,24.61 v64.93,26.51
  Bottom 0.203: v9.21,40.64 8.73,40.16 8.26,40.16 IC2.12 | v64.93,26.51 v47.78,26.51 | v66.83,24.61 67.31,24.61 67.94,23.97 R14.2
N$6  (via drill 0.41)
  Top 0.203: v59.37,52.23 v63.34,52.23 | v58.74,48.42 58.74,46.2 v60.01,44.93 | v71.91,26.35 75.41,22.86 v76.99,22.86
  Bottom 0.203: v63.34,52.23 63.34,50.96 IC3.10 | v59.37,52.23 59.37,51.91 58.74,51.28 v58.74,48.42 | v60.01,44.93 59.05,44.93 55.72,41.59 55.4,41.59 54.93,41.12 54.93,40.16 57.15,37.94 58.42,37.94 70.01,26.35 v71.91,26.35 | v76.99,22.86 83.66,22.86 84.14,23.34 85.72,23.34 85.88,23.18 90.17,23.18 90.81,23.81 R28.2
N$7  (via drill 0.41)
  Top 0.203: v9.53,36.35 9.53,34.45 v10.64,33.34 | v40.48,20.32 v38.42,22.38
  Bottom 0.203: v9.53,36.35 9.37,36.35 7.3,38.42 7.3,40.32 7.62,40.64 8.1,40.64 IC2.11 | v10.64,33.34 24.92,33.34 33.18,25.08 35.72,25.08 v38.42,22.38 | v40.48,20.32 44.13,20.32 45.09,19.37 R15.2
N$8  (via drill 0.41)
  Top 0.203: v63.5,47.15 v63.5,49.69 | v76.2,28.42 76.2,26.19 77.63,24.77 77.63,20.95 v77.79,20.8